# Altium schematic sheet Sheet1.SchDoc
size Letter; SheetNumber: 1; SheetTotal: 1; SPICEModelCacheZGJOGVXS: <root> / <DocumentId>ZGJOGVXS</DocumentId> / <CacheFrame Number="0"> / <Model Name="diode" Kind="MDL"> / <Text>*Default Diode / *Diode Pinout: A,K / .MODEL DIODE D()</Text> / </Model> / <Model Name="led0" Kind="MDL"> / <Text>*Typ INFRARED GaAs LED: Vf=1.2V Vr=5V If=40mA trr=3uS / *LED Pinout: 1=A, 2=K / .MODEL LED0 D (IS=93.5P RS=84M N=2.63 BV=5 IBV=10U / + CJO=2.97P VJ=.75 M=.333 TT=4.32U)</Text> / </Model> / </CacheFrame> / </root>
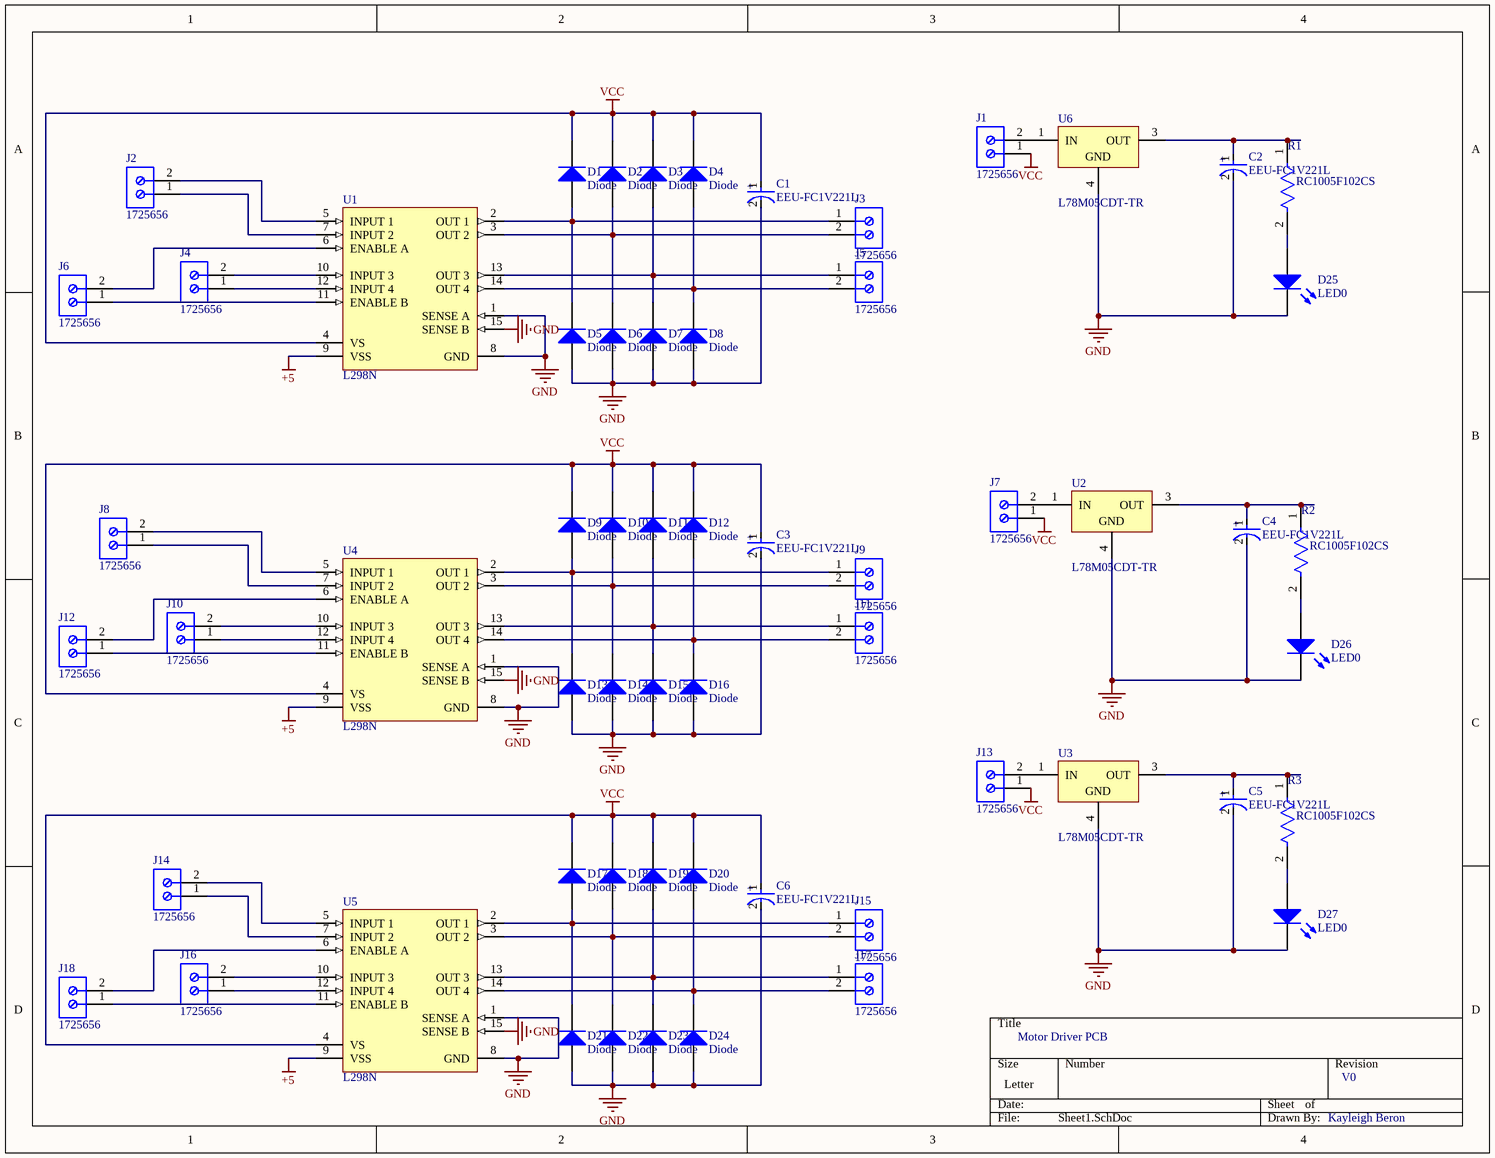
[diagram p0: Sheet1.SchDoc]

## Parts
C1  EEU-FC1V221L  [FP-EEU-FC1V221L-MFG]
C2  EEU-FC1V221L  [FP-EEU-FC1V221L-MFG]
C3  EEU-FC1V221L  [FP-EEU-FC1V221L-MFG]
C4  EEU-FC1V221L  [FP-EEU-FC1V221L-MFG]
C5  EEU-FC1V221L  [FP-EEU-FC1V221L-MFG]
C6  EEU-FC1V221L  [FP-EEU-FC1V221L-MFG]
D1  Diode  [SMC]
D2  Diode  [SMC]
D3  Diode  [SMC]
D4  Diode  [SMC]
D5  Diode  [SMC]
D6  Diode  [SMC]
D7  Diode  [SMC]
D8  Diode  [SMC]
D9  Diode  [SMC]
D10  Diode  [SMC]
D11  Diode  [SMC]
D12  Diode  [SMC]
D13  Diode  [SMC]
D14  Diode  [SMC]
D15  Diode  [SMC]
D16  Diode  [SMC]
D17  Diode  [SMC]
D18  Diode  [SMC]
D19  Diode  [SMC]
D20  Diode  [SMC]
D21  Diode  [SMC]
D22  Diode  [SMC]
D23  Diode  [SMC]
D24  Diode  [SMC]
D25  LED0  [LED-0]
D26  LED0  [LED-0]
D27  LED0  [LED-0]
J1  1725656  [PHOE-1725656-2]
J2  1725656  [PHOE-1725656-2]
J3  1725656  [PHOE-1725656-2]
J4  1725656  [PHOE-1725656-2]
J5  1725656  [PHOE-1725656-2]
J6  1725656  [PHOE-1725656-2]
J7  1725656  [PHOE-1725656-2]
J8  1725656  [PHOE-1725656-2]
J9  1725656  [PHOE-1725656-2]
J10  1725656  [PHOE-1725656-2]
J11  1725656  [PHOE-1725656-2]
J12  1725656  [PHOE-1725656-2]
J13  1725656  [PHOE-1725656-2]
J14  1725656  [PHOE-1725656-2]
J15  1725656  [PHOE-1725656-2]
J16  1725656  [PHOE-1725656-2]
J17  1725656  [PHOE-1725656-2]
J18  1725656  [PHOE-1725656-2]
R1  RC1005F102CS  [FP-RC1005-IPC_A]
R2  RC1005F102CS  [FP-RC1005-IPC_A]
R3  RC1005F102CS  [FP-RC1005-IPC_A]
U1  L298N  [STM-FM-15]
U2  L78M05CDT-TR  [TO-252_L]
U3  L78M05CDT-TR  [TO-252_L]
U4  L298N  [STM-FM-15]
U5  L298N  [STM-FM-15]
U6  L78M05CDT-TR  [TO-252_L]

## Nets
+5: U1.9(VSS) U4.9(VSS) U5.9(VSS)
GND: C1.2(A) C2.2(A) C3.2(A) C4.2(A) C5.2(A) C6.2(A) D5.1(A) D6.1(A) D7.1(A) D8.1(A) D13.1(A) D14.1(A) D15.1(A) D16.1(A) D21.1(A) D22.1(A) D23.1(A) D24.1(A) D25.2(K) D26.2(K) D27.2(K) U1.1(SENSE_A) U1.8(GND) U1.15(SENSE_B) U2.4(GND) U3.4(GND) U4.1(SENSE_A) U4.8(GND) U4.15(SENSE_B) U5.1(SENSE_A) U5.8(GND) U5.15(SENSE_B) U6.4(GND)
VCC: C1.1(C) C3.1(C) C6.1(C) D1.2(K) D2.2(K) D3.2(K) D4.2(K) D9.2(K) D10.2(K) D11.2(K) D12.2(K) D17.2(K) D18.2(K) D19.2(K) D20.2(K) J1.1 J7.1 J13.1 U1.4(VS) U4.4(VS) U5.4(VS)
NetC2_1: C2.1(C) R1.1 U6.3(OUT)
NetC4_1: C4.1(C) R2.1 U2.3(OUT)
NetC5_1: C5.1(C) R3.1 U3.3(OUT)
NetD1_1: D1.1(A) D5.2(K) J3.1 U1.2(OUT_1)
NetD2_1: D2.1(A) D6.2(K) J3.2 U1.3(OUT_2)
NetD3_1: D3.1(A) D7.2(K) J5.1 U1.13(OUT_3)
NetD4_1: D4.1(A) D8.2(K) J5.2 U1.14(OUT_4)
NetD9_1: D9.1(A) D13.2(K) J9.1 U4.2(OUT_1)
NetD10_1: D10.1(A) D14.2(K) J9.2 U4.3(OUT_2)
NetD11_1: D11.1(A) D15.2(K) J11.1 U4.13(OUT_3)
NetD12_1: D12.1(A) D16.2(K) J11.2 U4.14(OUT_4)
NetD17_1: D17.1(A) D21.2(K) J15.1 U5.2(OUT_1)
NetD18_1: D18.1(A) D22.2(K) J15.2 U5.3(OUT_2)
NetD19_1: D19.1(A) D23.2(K) J17.1 U5.13(OUT_3)
NetD20_1: D20.1(A) D24.2(K) J17.2 U5.14(OUT_4)
NetD25_1: D25.1(A) R1.2
NetD26_1: D26.1(A) R2.2
NetD27_1: D27.1(A) R3.2
NetJ1_2: J1.2 U6.1(IN)
NetJ2_1: J2.1 U1.7(INPUT_2)
NetJ2_2: J2.2 U1.5(INPUT_1)
NetJ4_1: J4.1 U1.12(INPUT_4)
NetJ4_2: J4.2 U1.10(INPUT_3)
NetJ6_1: J6.1 U1.11(ENABLE_B)
NetJ6_2: J6.2 U1.6(ENABLE_A)
NetJ7_2: J7.2 U2.1(IN)
NetJ8_1: J8.1 U4.7(INPUT_2)
NetJ8_2: J8.2 U4.5(INPUT_1)
NetJ10_1: J10.1 U4.12(INPUT_4)
NetJ10_2: J10.2 U4.10(INPUT_3)
NetJ12_1: J12.1 U4.11(ENABLE_B)
NetJ12_2: J12.2 U4.6(ENABLE_A)
NetJ13_2: J13.2 U3.1(IN)
NetJ14_1: J14.1 U5.7(INPUT_2)
NetJ14_2: J14.2 U5.5(INPUT_1)
NetJ16_1: J16.1 U5.12(INPUT_4)
NetJ16_2: J16.2 U5.10(INPUT_3)
NetJ18_1: J18.1 U5.11(ENABLE_B)
NetJ18_2: J18.2 U5.6(ENABLE_A)

## Notes on the sheet
- Motor Driver PCB
- V0
- Kayleigh Beron
- (in symbol CMP-05427-000010-1) +

## Library data of the parts
C1-C6 = CMP-05427-000010-1: CAP ALUM 220UF 20% 35V RADIAL; Manufacturer: Panasonic Electronic Components; Material: Aluminum; Leakage Current: 77uA; Esr: 0.085Ω; Life: 2000Hours; Automotive Grade: Grade 2; Dissipation Factor: 12%; Ripple Current: 730mA; Octopart: https://octopart.com/eeu-fc1v221l-panasonic-39478519; ComponentLink2URL: https://industrial.panasonic.com/cdbs/www-data/pdf/RDF0000/ABA0000C1209.pdf; Package: 0; Height: 16.5mm; Category: Cap; Value: 220uF; ComponentLink2Description: Datasheet; Lead Free: Yes; Device Class L2: Capacitors; Temperature Range High: +105°C; Mouser Description: Capacitor; Aluminum Electrolytic; Fc Radial Elec Cap 220uF 35V; Temperature: -55°C to +105°C; Digikey Description: CAP ALUM 220UF 20% 35V RADIAL; Device Class L3: Aluminum Electrolytic Capacitors; Manufacturer Part Number: EEU-FC1V221L; Device Class L1: Passive Components; Automotive: Yes; RoHS: TRUE; Temperature Range Low: -55°C; Capacitance: 220uF; Voltage Rating: 35V; Tolerance: 20%
D1-D24 = Diode: Default Diode; Published: 8-Jun-2000; LatestRevisionDate: 17-Jul-2002; LatestRevisionNote: Re-released for DXP Platform.; PackageVersion: Sep-1996; PackageReference: SMC; Publisher: Altium Limited; PackageDescription: DO-214-AB/SMC; 2 C-Bend Leads; Body 7.9 x 5.9 mm, inc. leads (LxW); Code_JEDEC: DO-214-AB
D25-D27 = LED0: Typical INFRARED GaAs LED; Published: 8-Jun-2000; LatestRevisionDate: 08-Jul-2005; LatestRevisionNote: Mech Layer 1 removed.; PackageReference: LED-0; Publisher: Altium Limited; PackageDescription: LED; 2 Leads
J1-J18 = CMP-2000-05299-1: Male Header, Pitch 2.54 mm, 1 x 2 Position, Height 9 mm, Tail Length 3.5 mm; Manufacturer: Phoenix Contact; Number of contacts: 2; Content: 250pc(s); Pitch: 2.54mm; Industrial packaging: Yes; Colour: Green; Manufacturer part No.: 1725656; Type: MPT0,5/2-2,54; Datasheet URL: http://datasheet.octopart.com/1725656-Phoenix-Contact-datasheet-5302866.pdf; Manufacturer URL: http://www.phoenixcontact.com/; Datasheet Version: Apr-08
R1-R3 = CMP-13261-004451-1: Res Thick Film 0402 1kΩ 1% 0.063W ±100ppm/°C Molded SMD T/R; Voltage Rating (DC): 50V; Max Power Dissipation: 63mW; Resistance: 1kR; Composition: Thick Film; Lead Free: Lead Free; Max Operating Temperature: 155°C; Height: 0.016inch; Number of Terminations: 2; Features: Moisture Resistant; Min Operating Temperature: -55°C; Temperature Coefficient: 100ppm/°C; Case Code (Imperial): 0402; Radiation Hardening: No; Military Standard: Not; Depth: 0.5mm; Tolerance: 1%; Case/Package: 0402; Case Code (Metric): 1005; Packaging: Tape and Reel; Length: 1mm; Width: 0.02inch; Contact Plating: Tin
U1 U4 U5 = CMP-2000-06526-1: Dual Full-Bridge Driver, 4.8 to 46 V, -40 to 150 degC, 15-Pin FM (MW 15L), RoHS, Tube; Manufacturer: STMicroelectronics; PartNumber: L298; Output Current: 2A; Supply Voltage Max: 7V; Driver Case Style: Multiwatt; Supply Voltage Min: 4.5V; No. of Pins: 15Pins; SVHC: NoSVHC(17-Dec-2015); Output Voltage: 46V; No. of Outputs: 4Outputs; Motor Type: FullBridge; MSL: -; Package Description: 15-Pin Flange Mount, Body 5 x 19.6 mm, Pitch 1.27 mm; Datasheet Version: 01/2000; Package Reference: FM-15; Mounting Technology: ThroughHole; Packaging: Each; Automotive Qualification Standard: -; Product Range: -; Datasheet URL: https://datasheet.ciiva.com/15109/getdatasheetpartid-50682-15109332.pdf; Operating Temperature Max: 130°C; Operating Temperature Min: -25°C; Manufacturer URL: http://www.st.com/
U2 U3 U6 = CMP-0244-00178-1: Positive Voltage Regulator, 5V, 3-Pin DPAK, Tape and Reel; PackageReference: TO-252; ComponentLink1URL: http://www.st.com; ComponentLink2Description: Datasheet; PackageDescription: 3-Pin Transistor Outline Package 2.28 mm Pitch, 9.7 mm Lead Span (DPAK); ComponentLink1Description: Manufacturer URL; DatasheetVersion: 1/11/2010; ComponentLink2URL: http://www.st.com/internet/com/TECHNICAL_RESOURCES/TECHNICAL_LITERATURE/DATASHEET/CD00000447.pdf; PackageVersion: 2011